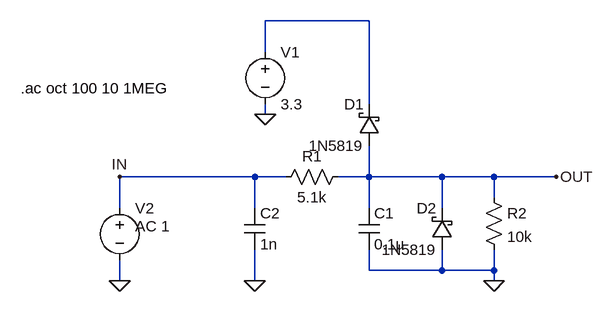
[diagram p0: schematic adc_input_ac.asc]
adc_input_ac.asc, the LTspice schematic file:
Version 4
SHEET 1 880 680
WIRE 112 -144 -48 -144
WIRE -48 -96 -48 -144
WIRE 112 -16 112 -144
WIRE -48 0 -48 -16
WIRE -64 96 -272 96
WIRE -16 96 -64 96
WIRE 112 96 112 48
WIRE 112 96 64 96
WIRE 224 96 112 96
WIRE 304 96 224 96
WIRE 400 96 304 96
WIRE 304 128 304 96
WIRE -272 144 -272 96
WIRE -64 144 -64 96
WIRE 112 144 112 96
WIRE 224 144 224 96
WIRE 112 240 112 208
WIRE 224 240 224 208
WIRE 224 240 112 240
WIRE 304 240 304 208
WIRE 304 240 224 240
WIRE -272 256 -272 224
WIRE -64 256 -64 208
WIRE 304 256 304 240
FLAG -64 256 0
FLAG 304 256 0
FLAG 400 96 OUT
FLAG -48 0 0
FLAG -272 256 0
FLAG -272 96 IN
SYMBOL res -32 112 R270
WINDOW 0 32 56 VTop 2
WINDOW 3 0 56 VBottom 2
SYMATTR InstName R1
SYMATTR Value 5.1k
SYMATTR SpiceLine tol=1
SYMBOL cap 96 144 R0
SYMATTR InstName C1
SYMATTR Value 0.1µ
SYMBOL cap -80 144 R0
SYMATTR InstName C2
SYMATTR Value 1n
SYMBOL res 288 112 R0
SYMATTR InstName R2
SYMATTR Value 10k
SYMATTR SpiceLine tol=1
SYMBOL schottky 128 48 R180
WINDOW 0 24 64 Left 2
WINDOW 3 24 0 Left 2
SYMATTR InstName D1
SYMATTR Value 1N5819
SYMBOL schottky 240 208 R180
WINDOW 0 24 64 Left 2
WINDOW 3 24 0 Left 2
SYMATTR InstName D2
SYMATTR Value 1N5819
SYMBOL voltage -48 -112 R0
WINDOW 123 0 0 Left 2
WINDOW 39 0 0 Left 2
SYMATTR InstName V1
SYMATTR Value 3.3
SYMBOL voltage -272 128 R0
WINDOW 123 24 44 Left 2
WINDOW 39 0 0 Left 2
SYMATTR InstName V2
SYMATTR Value ""
SYMATTR Value2 AC 1
TEXT -424 -40 Left 2 !.ac oct 100 10 1MEG

The netlist it stands for:
* adc_input_ac.asc
R1 IN OUT 5.1k tol=1
C1 OUT 0 0.1µ
C2 IN 0 1n
R2 OUT 0 10k tol=1
D1 OUT N001 1N5819
D2 0 OUT 1N5819
V1 N001 0 3.3
V2 IN 0 AC 1
.model D D
.lib standard.dio
.ac oct 100 10 1MEG
.backanno
.end